# EAGLE design integratedBertha_no_weight (EAGLE 6.6.0)
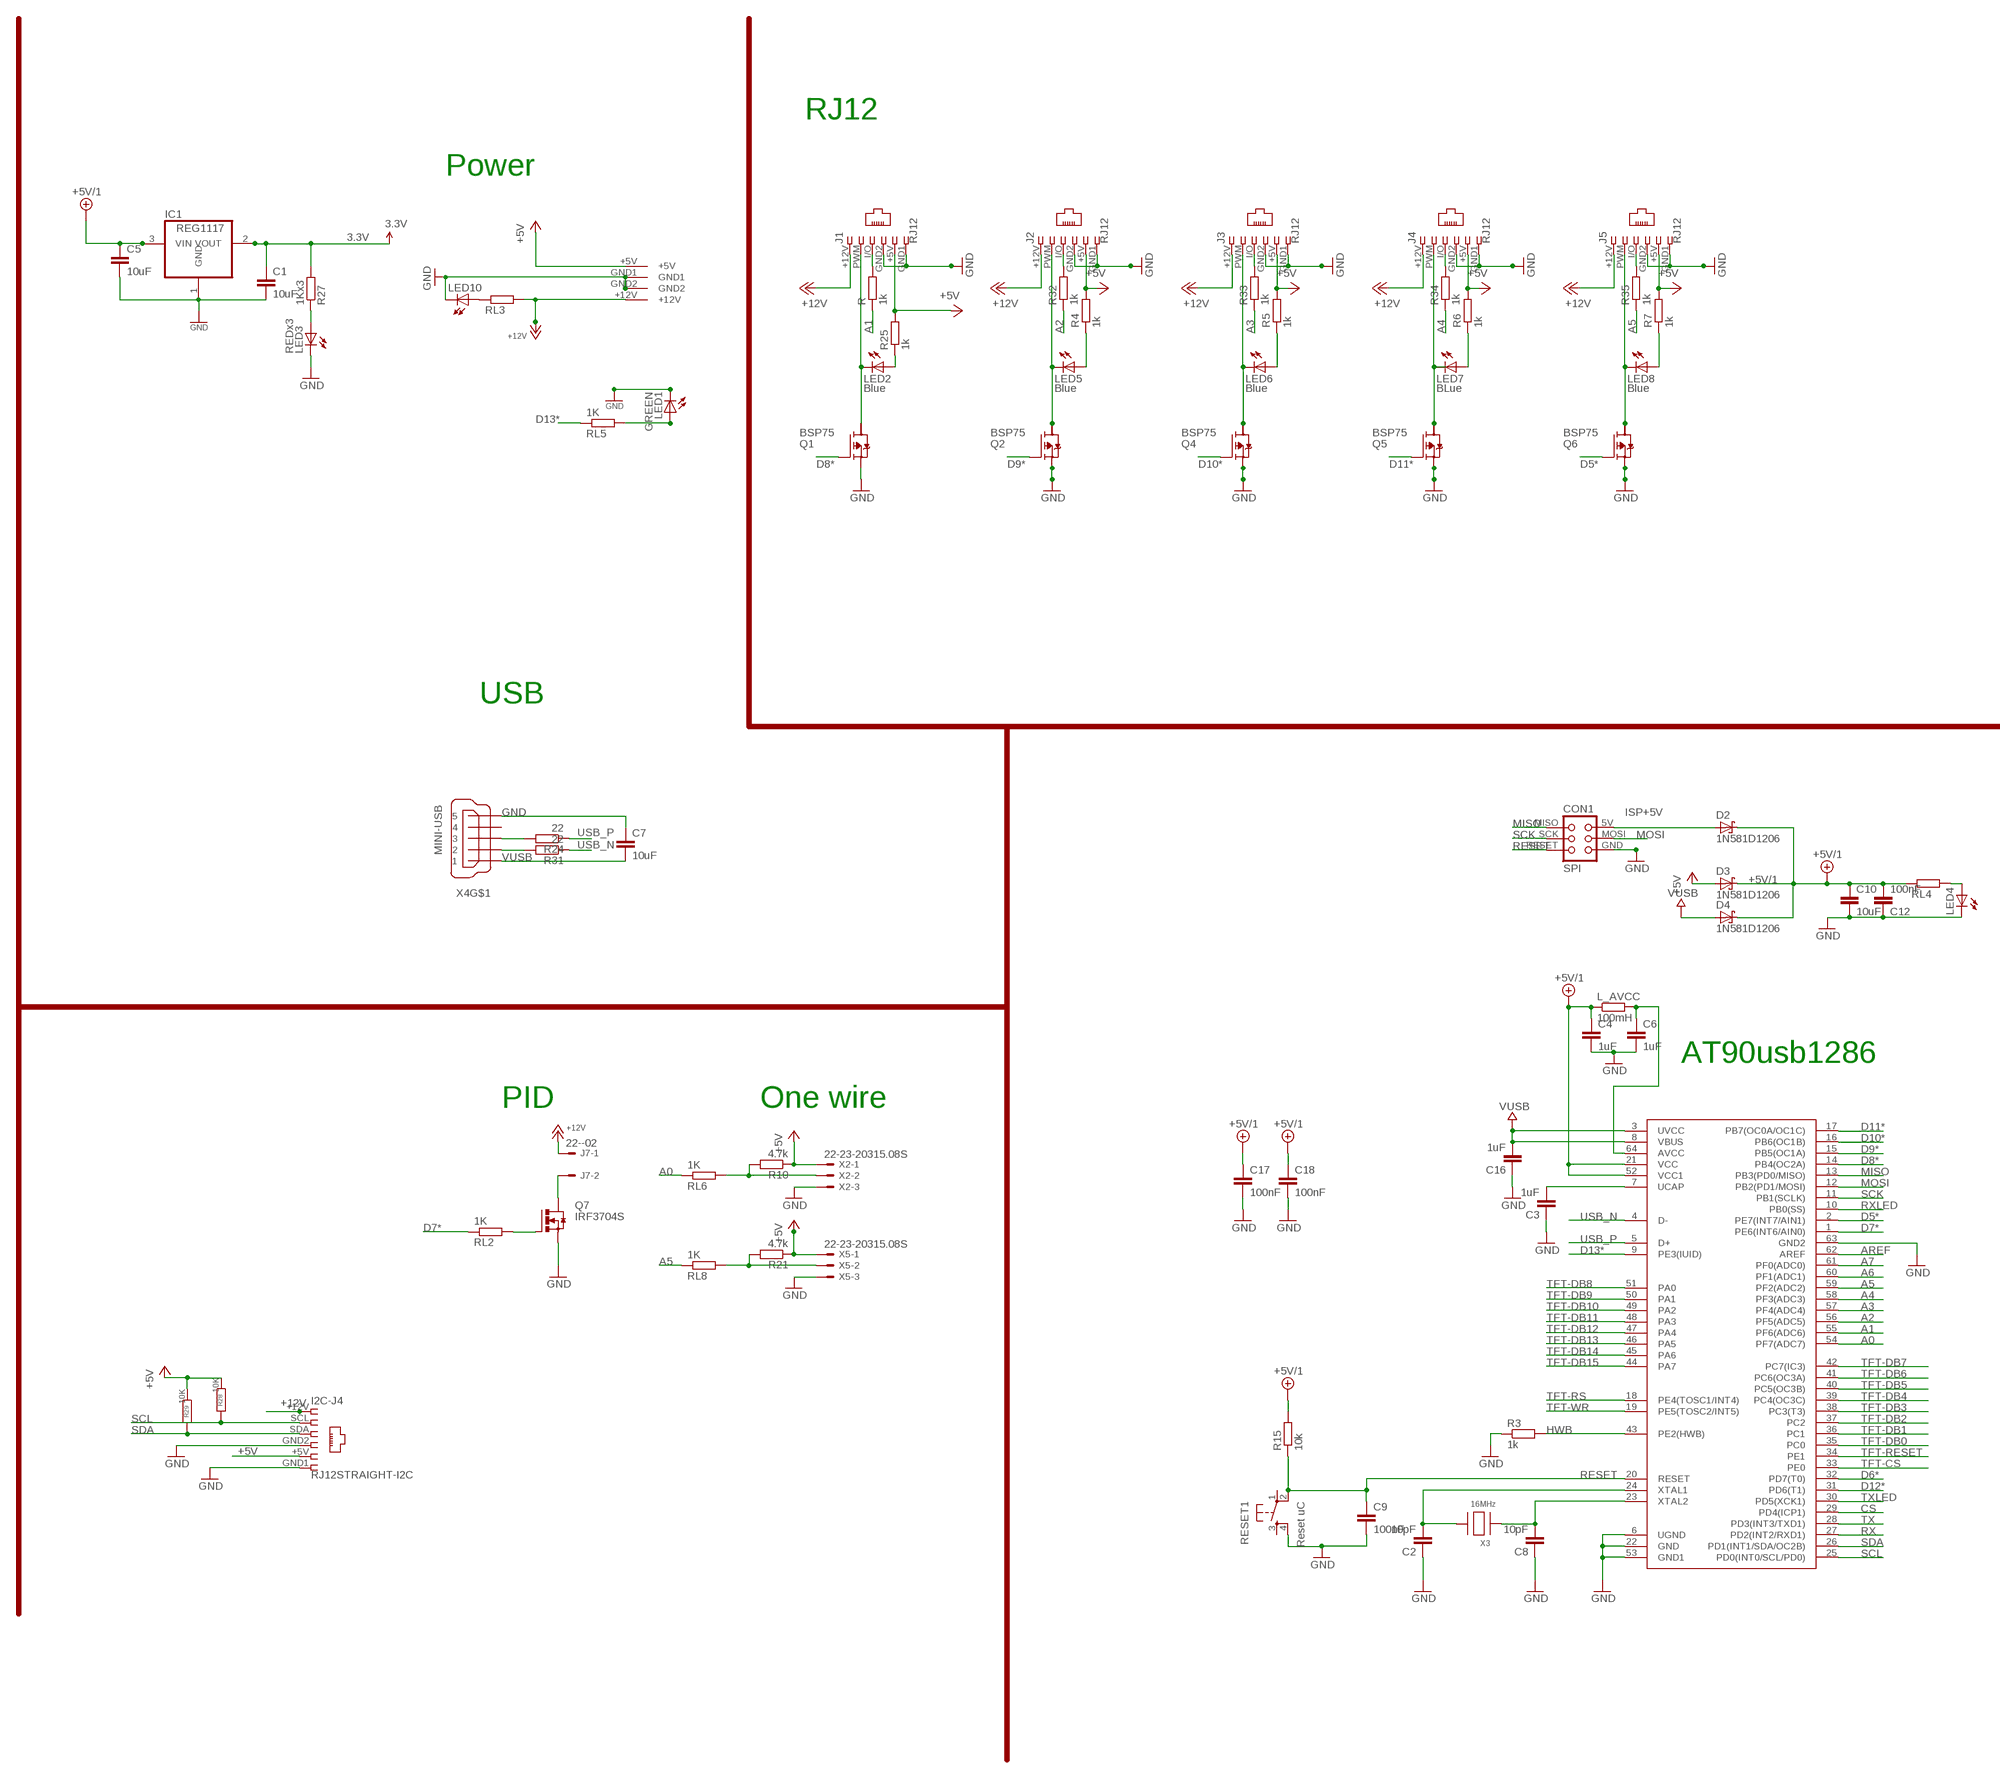
[diagram p0: schematic, sheet 1, part 1 of 2]
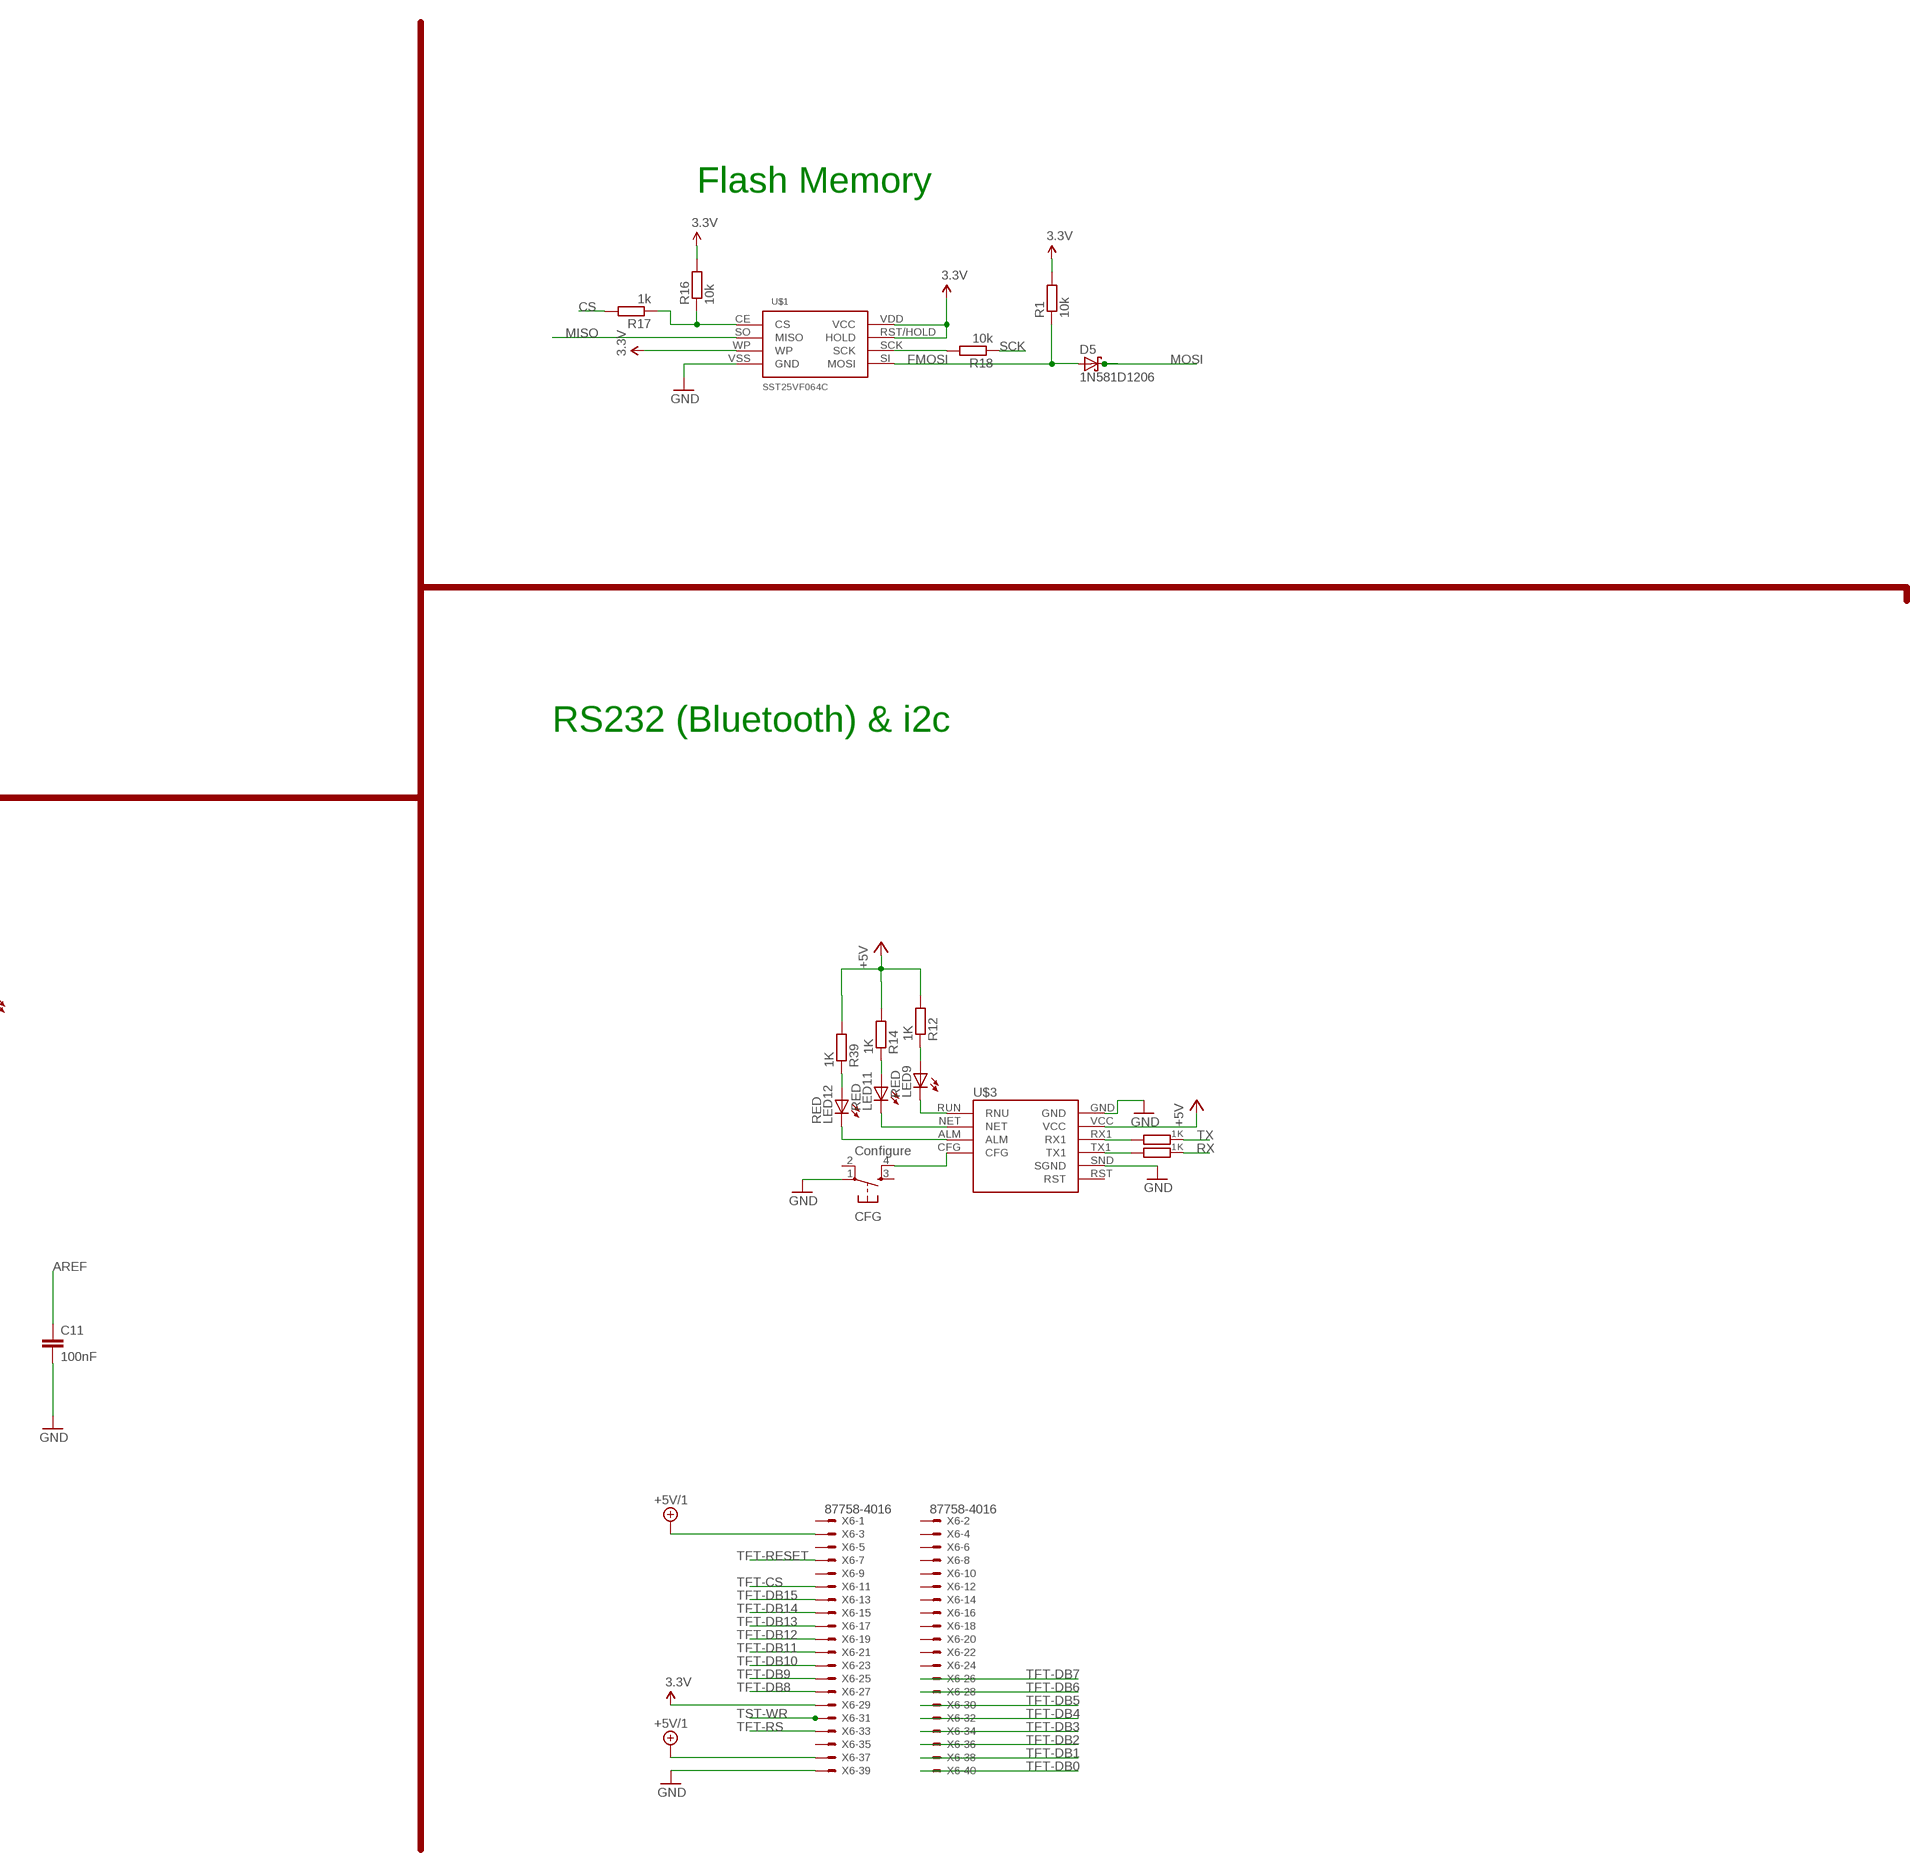
[diagram p1: schematic, sheet 1, part 2 of 2]

## Parts
C1  10uF  C-EUC1206  [C1206]
C2  10pF  C-EUC1206  [C1206]
C3  1uF  C-EUC1206  [C1206]
C4  1uF  C-EUC1206  [C1206]
C5  10uF  C-EUC1206  [C1206]
C6  1uF  C-EUC1206  [C1206]
C7  10uF  C-EUC1206  [C1206]
C8  10pF  C-EUC1206  [C1206]
C9  100nF  C-EUC1206  [C1206]
C10  10uF  C-EUC1206  [C1206]
C11  100nF  C-EUC1206  [C1206]
C12  100nF  C-EUC1206  [C1206]
C16  1uF  C-EUC1206  [C1206]
C17  100nF  C-EUC1206  [C1206]
C18  100nF  C-EUC1206  [C1206]
CFG  Configure  TAC_SWITCHSMD  [TACTILE_SWITCH_SMD]
CON1  SPI  TINYISPT  [TC2030-MCP-NL]
D2  1N581D1206  [LED-1206]
D3  1N581D1206  [LED-1206]
D4  1N581D1206  [LED-1206]
D5  1N581D1206  [LED-1206]
I2C-J4  RJ12STRAIGHT-I2C  [RJ12-STRAIGHT-I2C]
IC1  REG1117  [SOT223]
J1  RJ12  RJ12STRAIGHT  [RJ12-STRAIGHT]
J2  RJ12  RJ12STRAIGHT  [RJ12-STRAIGHT]
J3  RJ12  RJ12STRAIGHT  [RJ12-STRAIGHT]
J4  RJ12  RJ12STRAIGHT  [RJ12-STRAIGHT]
J5  RJ12  RJ12STRAIGHT  [RJ12-STRAIGHT]
J7  22--02  [2-PIN-5.08S]
L_AVCC  100mH  R-EU_R1206  [R1206]
LED1  GREEN  LEDCHIPLED_1206  [CHIPLED_1206]
LED2  Blue  LEDCHIPLED_1206  [CHIPLED_1206]
LED3  REDx3  LEDCHIPLED_1206  [CHIPLED_1206]
LED4  LEDCHIPLED_1206  [CHIPLED_1206]
LED5  Blue  LEDCHIPLED_1206  [CHIPLED_1206]
LED6  Blue  LEDCHIPLED_1206  [CHIPLED_1206]
LED7  BLue  LEDCHIPLED_1206  [CHIPLED_1206]
LED8  Blue  LEDCHIPLED_1206  [CHIPLED_1206]
LED9  RED  LEDCHIPLED_1206  [CHIPLED_1206]
LED10  LEDCHIPLED_1206  [CHIPLED_1206]
LED11  RED  LEDCHIPLED_1206  [CHIPLED_1206]
LED12  RED  LEDCHIPLED_1206  [CHIPLED_1206]
Q1  BSP75  BSP613P  [PG-SOT-223]
Q2  BSP75  BSP613P  [PG-SOT-223]
Q4  BSP75  BSP613P  [PG-SOT-223]
Q5  BSP75  BSP613P  [PG-SOT-223]
Q6  BSP75  BSP613P  [PG-SOT-223]
Q7  IRF3704S  [D2PACK]
R  1k  R-EU_R0805  [R0805]
R1  10k  R-EU_R0805  [R0805]
R3  1k  R-EU_M0805  [M0805]
R4  1k  R-EU_R0805  [R0805]
R5  1k  R-EU_R0805  [R0805]
R6  1k  R-EU_R0805  [R0805]
R7  1k  R-EU_R0805  [R0805]
R8  1K  R-EU_R0805  [R0805]
R10  4.7k  R-EU_R1206  [R1206]
R11  1K  R-EU_R0805  [R0805]
R12  1K  R-EU_R0805  [R0805]
R14  1K  R-EU_R0805  [R0805]
R15  10k  R-EU_M0805  [M0805]
R16  10k  R-EU_R0805  [R0805]
R17  1k  R-EU_R0805  [R0805]
R18  10k  R-EU_R0805  [R0805]
R21  4.7k  R-EU_R1206  [R1206]
R24  22  R-EU_M1206  [M1206]
R25  1k  R-EU_R0805  [R0805]
R27  1Kx3  R-EU_R0805  [R0805]
R28  10K  R-EU_M0805  [M0805]
R29  10K  R-EU_M0805  [M0805]
R31  22  R-EU_M1206  [M1206]
R32  1k  R-EU_R0805  [R0805]
R33  1k  R-EU_R0805  [R0805]
R34  1k  R-EU_R0805  [R0805]
R35  1k  R-EU_R0805  [R0805]
R39  1K  R-EU_R0805  [R0805]
RESET1  Reset uC  TAC_SWITCHSMD  [TACTILE_SWITCH_SMD]
RL2  1K  R-EU_R0805  [R0805]
RL3  R-EU_R0805  [R0805]
RL4  R-EU_R0805  [R0805]
RL5  1K  R-EU_R0805  [R0805]
RL6  1K  R-EU_R0805  [R0805]
RL8  1K  R-EU_R0805  [R0805]
U$1  SST25VF064C  [SOIC_8-LEAD]
U$2  AT90USB1286  AT90USB1286TQFP64  [TQFP64]
U$3  SZ05-ZIGBEETHROUGHHOLE  [SZ05-ZIGBEE4]
U$6  KPJX-4S-S  [KPJX-4S-S]
X2  22-23-20315.08S  [3-PIN-5.08S]
X3  16MHz  XTALNX6035  [NX6035]
X4  MINI-USB  MINI-USB-SCHIELD-32005-201  [32005-201]
X5  22-23-20315.08S  [3-PIN-5.08S]
X6  87758-4016  [87758-4016]

## Nets
3.3V [power]: C1.1 IC1.2(VOUT) R1.2 R16.2 R27.2 U$1.RST/HOLD(HOLD) U$1.VDD(VCC) U$1.WP X6.29
+5V [power]: D3.A I2C-J4.+5V J1.+5V J2.+5V J3.+5V J4.+5V J5.+5V R4.2 R5.2 R6.2 R7.2 R10.1 R12.2 R14.2 R21.1 R25.2 R28.1 R29.1 R39.2 U$3.VCC U$6.+5V X2.1 X5.1
+5V/1 [fine]: C4.1 C5.1 C10.1 C12.2 C17.1 C18.1 D2.C D3.C D4.C IC1.3(VIN) L_AVCC.1 R15.2 RL4.1 U$2.21(VCC) U$2.52(VCC1) X6.3 X6.37
+12V [power]: I2C-J4.+12V J1.+12V J2.+12V J3.+12V J4.+12V J5.+12V J7.1 RL3.2 U$6.+12V
A0: RL6.1 U$2.54(PF7(ADC7))
A1: R.1 U$2.55(PF6(ADC6))
A2: R32.1 U$2.56(PF5(ADC5))
A3: R33.1 U$2.57(PF4(ADC4))
A4: R34.1 U$2.58(PF3(ADC3))
A5: R35.1 RL8.1 U$2.59(PF2(ADC2))
A6: U$2.60(PF1(ADC1))
A7: U$2.61(PF0(ADC0))
AREF: C11.1 U$2.62(AREF)
CS: R17.2 U$2.29(PD4(ICP1))
D5*: Q6.1(G) U$2.2(PE7(INT7/AIN1))
D6*: U$2.32(PD7(T0))
D7*: RL2.1 U$2.1(PE6(INT6/AIN0))
D8*: Q1.1(G) U$2.14(PB4(OC2A))
D9*: Q2.1(G) U$2.15(PB5(OC1A))
D10*: Q4.1(G) U$2.16(PB6(OC1B))
D11*: Q5.1(G) U$2.17(PB7(OC0A/OC1C))
D12*: U$2.31(PD6(T1))
D13*: RL5.1 U$2.9(PE3(IUID))
FMOSI: D5.A R1.1 U$1.SI(MOSI)
GND [power]: C1.2 C2.1 C3.1 C4.2 C5.2 C6.2 C7.1 C8.1 C9.2 C10.2 C11.2 C12.1 C16.1 C17.2 C18.2 CFG.1 CON1.GND I2C-J4.GND1 I2C-J4.GND2 IC1.1(GND) J1.GND1 J1.GND2 J2.GND1 J2.GND2 J3.GND1 J3.GND2 J4.GND1 J4.GND2 J5.GND1 J5.GND2 LED1.C LED3.C LED4.C LED10.C Q1.3(S) Q2.3(S) Q4.3(S) Q5.3(S) Q6.3(S) Q7.3(S) R3.1 RESET1.4 U$1.VSS(GND) U$2.6(UGND) U$2.22(GND) U$2.53(GND1) U$2.63(GND2) U$3.GND U$3.SND(SGND) U$6.GND1 U$6.GND2 X2.3 X4.5 X5.3 X6.39
GND1 [VIN]: LED9.C U$3.RUN(RNU)
GND2 [VIN]: LED11.C U$3.NET
GND3 [VIN]: LED12.C U$3.ALM
HWB: R3.2 U$2.43(PE2(HWB))
ISP+5V: CON1.5V(VCC) D2.A
MISO: CON1.MISO U$1.SO(MISO) U$2.13(PB3(PD0/MISO))
MOSI: CON1.MOSI D5.C U$2.12(PB2(PD1/MOSI))
N$1: J3.PWM LED6.C Q4.2(D)
N$2: J2.I/O R32.2
N$3: LED1.A RL5.2
N$4: LED5.A R4.1
N$5: J4.PWM LED7.C Q5.2(D)
N$6: Q7.1(G) RL2.2
N$7: J3.I/O R33.2
N$8: C3.2 U$2.7(UCAP)
N$9 [power]: R21.2 RL8.2 X5.2
N$10: R16.1 R17.1 U$1.CE(CS)
N$11: R11.2 U$3.RX1
N$12: LED4.A RL4.2
N$13: C6.1 L_AVCC.2 U$2.64(AVCC)
N$14: C2.2 U$2.24(XTAL1) X3.P$2
N$17: LED2.A R25.1
N$18: J1.I/O R.2
N$19: J5.PWM LED8.C Q6.2(D)
N$20: LED3.A R27.1
N$21 [power]: R10.2 RL6.2 X2.2
N$22: LED6.A R5.1
N$23: R18.2 U$1.SCK
N$24: R8.2 U$3.TX1
N$25: LED9.A R12.1
N$26: LED11.A R14.1
N$27: LED12.A R39.1
N$28: J2.PWM LED5.C Q2.2(D)
N$29: J4.I/O R34.2
N$30: LED7.A R6.1
N$32: J5.I/O R35.2
N$33: LED8.A R7.1
N$34: J1.PWM LED2.C Q1.2(D)
N$35: CFG.4 U$3.CFG
N$36: J7.2 Q7.2(D)
N$39: C8.2 U$2.23(XTAL2) X3.P$1
N$75: LED10.A RL3.1
RESET: C9.1 CON1.RESET R15.1 RESET1.2 U$2.20(RESET)
RX: R8.1 U$2.27(PD2(INT2/RXD1))
RXLED: U$2.10(PB0(SS))
SCK: CON1.SCK R18.1 U$2.11(PB1(SCLK))
SCL: I2C-J4.SCL R28.2 U$2.25(PD0(INT0/SCL/PD0))
SDA: I2C-J4.SDA R29.2 U$2.26(PD1(INT1/SDA/OC2B))
TFT-CS: U$2.33(PE0) X6.11
TFT-DB0: U$2.35(PC0) X6.40
TFT-DB1: U$2.36(PC1) X6.38
TFT-DB2: U$2.37(PC2) X6.36
TFT-DB3: U$2.38(PC3(T3)) X6.34
TFT-DB4: U$2.39(PC4(OC3C)) X6.32
TFT-DB5: U$2.40(PC5(OC3B)) X6.30
TFT-DB6: U$2.41(PC6(OC3A)) X6.28
TFT-DB7: U$2.42(PC7(IC3)) X6.26
TFT-DB8: U$2.51(PA0) X6.27
TFT-DB9: U$2.50(PA1) X6.25
TFT-DB10: U$2.49(PA2) X6.23
TFT-DB11: U$2.48(PA3) X6.21
TFT-DB12: U$2.47(PA4) X6.19
TFT-DB13: U$2.46(PA5) X6.17
TFT-DB14: U$2.45(PA6) X6.15
TFT-DB15: U$2.44(PA7) X6.13
TFT-RESET: U$2.34(PE1) X6.7
TFT-RS: U$2.18(PE4(TOSC1/INT4)) X6.33
TFT-WR: U$2.19(PE5(TOSC2/INT5))
TST-WR: X6.31
TX: R11.1 U$2.28(PD3(INT3/TXD1))
TXLED: U$2.30(PD5(XCK1))
USB_N: R31.1 U$2.4(D-)
USB_P: R24.1 U$2.5(D+)
USBC_N: R31.2 X4.2
USBC_P: R24.2 X4.3
VUSB: C7.2 C16.2 D4.A U$2.3(UVCC) U$2.8(VBUS) X4.1
Unconnected: CFG.2 CFG.3 Q1.4(D) Q2.4(D) Q4.4(D) Q5.4(D) Q6.4(D) RESET1.1 RESET1.3 U$3.RST X4.4 X4.M1(S:S1) X4.M2(S:S2) X4.M3(S:S3) X4.M4(S:S4) X6.1 X6.2 X6.4 X6.5 X6.6 X6.8 X6.9 X6.10 X6.12 X6.14 X6.16 X6.18 X6.20 X6.22 X6.24 X6.35

## Notes on the sheet
- RJ12
- Power
- Flash Memory
- RS232 (Bluetooth) & i2c
- USB
- AT90usb1286
- PID | One wire

## Library data of the parts
C1-C12 C16-C18 = rcl:C-EU: CAPACITOR, European symbol
CFG RESET1 = lpatiny:TAC_SWITCH: Momentary Switch Button commonly used for reset or general input. Spark Fun Electronics SKU : COM-00097
CON1 = lpatiny:TINYISP: CONNECTOR
D2-D5 = lpatiny:1N581*: 1.0A SCHOTTKY BARRIER RECTIFIER Source: http://www.diodes.com/datasheets/ds23001.pdf
I2C-J4 J1-J5 = lpatiny:RJ12: CORCOM Modular RJ Jacks No Shield Source: www.tycoelectronics.com .. ENG_DS_1654001_1099_RJ_L_0507.pdf
IC1 = burr-brown:REG1117: 800mA and 1A Low Dropout (LDO) Positive Regulator 1.8V, 2.5V, 2.85V, 3.3V, 5V, and Adj; MPN: REG1117; OC_FARNELL: 1097566; OC_NEWARK: 14P6981
J7 = lpatiny:22-?-02: CONNECTOR wire to board 2.54 mm (.1 inch) pitch header
L_AVCC R3 R10 R15 R21 R24 R28 R29 R31 RL4 = resistor:R-EU_: RESISTOR, European symbol
LED1-LED12 = adafruit:LED: LED OSRAM: - CHIPLED LG R971, LG N971, LY N971, LG Q971, LY Q971, LO R971, LY R971 LH N974, LH R974 LS Q976, LO Q976, LY Q976 LO Q996 - Hyper CHIPLED LW Q18S LB Q993, LB Q99A, LB R99A - SideLED LS A670, LO A670, LY A670, LG A670, LP A670 LB A673, LV A673, LT A673, LW A673 LH A674 LY A675 LS A676, LA A676, LO A676, LY A676, LW A676 LS A679, LY A679, LG A679 - Hyper Micro SIDELED® LS Y876, LA Y876, LO Y876, LY Y876 LT Y87S - SmartLED LW L88C, LW L88S LB L89C, LB L89S, LG L890 LS L89K, LO L89K, LY L89K LS L896, LA L896, LO L896, LY L896 - TOPLED LS T670, LO T670, LY T670, LG T670, LP T670 LSG T670, LSP T670, LSY T670, LOP T670, LYG T670 LG T671, LOG T671, LSG T671 LB T673, LV T673, LT T673, LW T673 LH T674 LS T676, LA T676, LO T676, LY T676, LB T676, LH T676, LSB T676, LW T676 LB T67C, LV T67C, LT T67C, LS T67K, LO T67K, LY T67K, LW E67C LS E67B, LA E67B, LO E67B, LY E67B, LB E67C, LV E67C, LT E67C LW T67C LS T679, LY T679, LG T679 LS T770, LO T770, LY T770, LG T770, LP T770 LB T773, LV T773, LT T773, LW T773 LH T774 LS E675, LA E675, LY E675, LS T675 LS T776, LA T776, LO T776, LY T776, LB T776 LHGB T686 LT T68C, LB T68C - Hyper Mini TOPLED® LB M676 - Mini TOPLED Santana® LG M470 LS M47K, LO M47K, LY M47K Source: http://www.osram.convergy.de/
Q1 Q2 Q4-Q6 = infineon:BSP613P: SIPMOS (R) Small-Signal-Transistor P-Channel (2 Drain) Source: http://www.infineon.com/dgdl/BSP613P_Rev2.4.pdf; OC_FARNELL: unknown; OC_NEWARK: unknown
Q7 = transistor-power:IRF3704: SMPS MOSFET HEXFET® Power MOSFET Source: http://www.irf.com/product-info/datasheets/data/irf3704.pdf
R R1 R4-R8 R11 R12 R14 R16-R18 R25 R27 R32-R35 R39 RL2 RL3 RL5 RL6 RL8 = rcl:R-EU_: RESISTOR, European symbol
U$1 = BertaLib:SST25VF064C
U$2 = lpatiny:AT90USB1286
U$3 = lpatiny:SZ05-ZIGBEE
U$6 = lpatiny:KPJX-4S-S
X2 X5 = lpatiny:22-23-2031: .100" (2.54mm) Center Header - 3 Pin
X3 = lpatiny:XTAL: Low cost SMT crystals, no capacitors included http://www.ladyada.net/library/eagle
X4 = con-cypressindustries:MINI-USB-SCHIELD-: MINI USB-B Conector Source: www.cypressindustries.com; OC_FARNELL: unknown; OC_NEWARK: unknown
X6 = con-molex:87758-4016: 40 Pin - 2mm Dual Row Single Wafer, Vertical T/H HDR Source: http://www.molex.com/pdm_docs/sd/877580616_sd.pdf; MPN: 87758-4016; OC_FARNELL: unknown; OC_NEWARK: 25M5691

## Net classes
0 default: width 0.356 mm
1 power: width 0.457 mm
2 VIN: width 0.457 mm
3 fine: width 0.356 mm
4 aref: width 0.356 mm

## Board
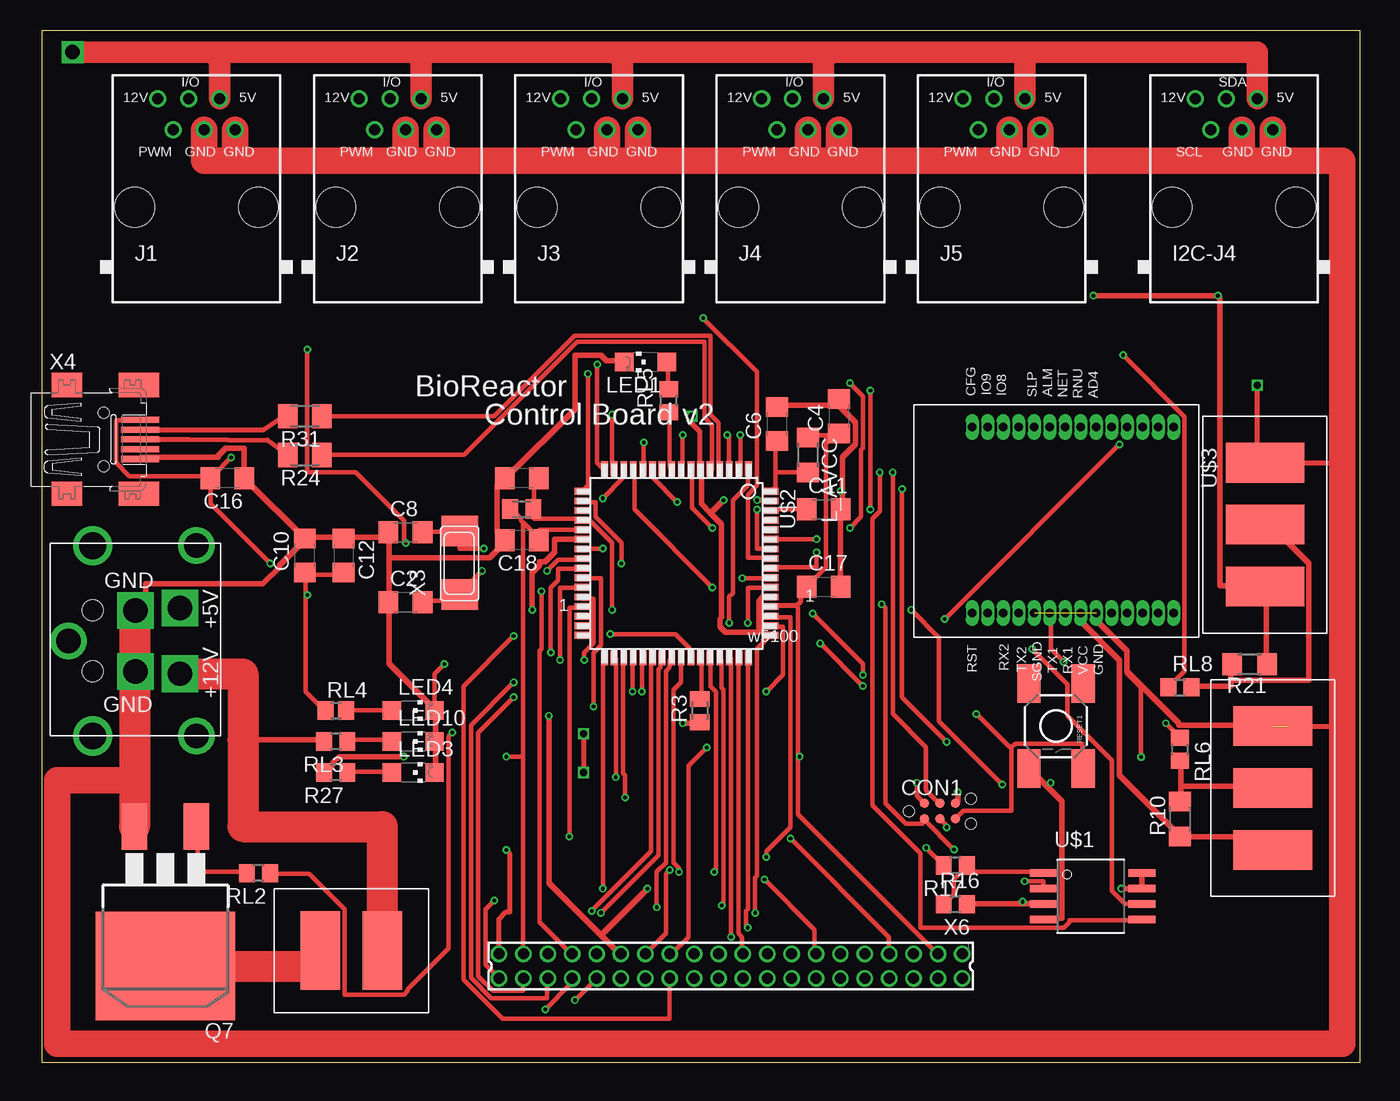
[diagram p2: board, top side]
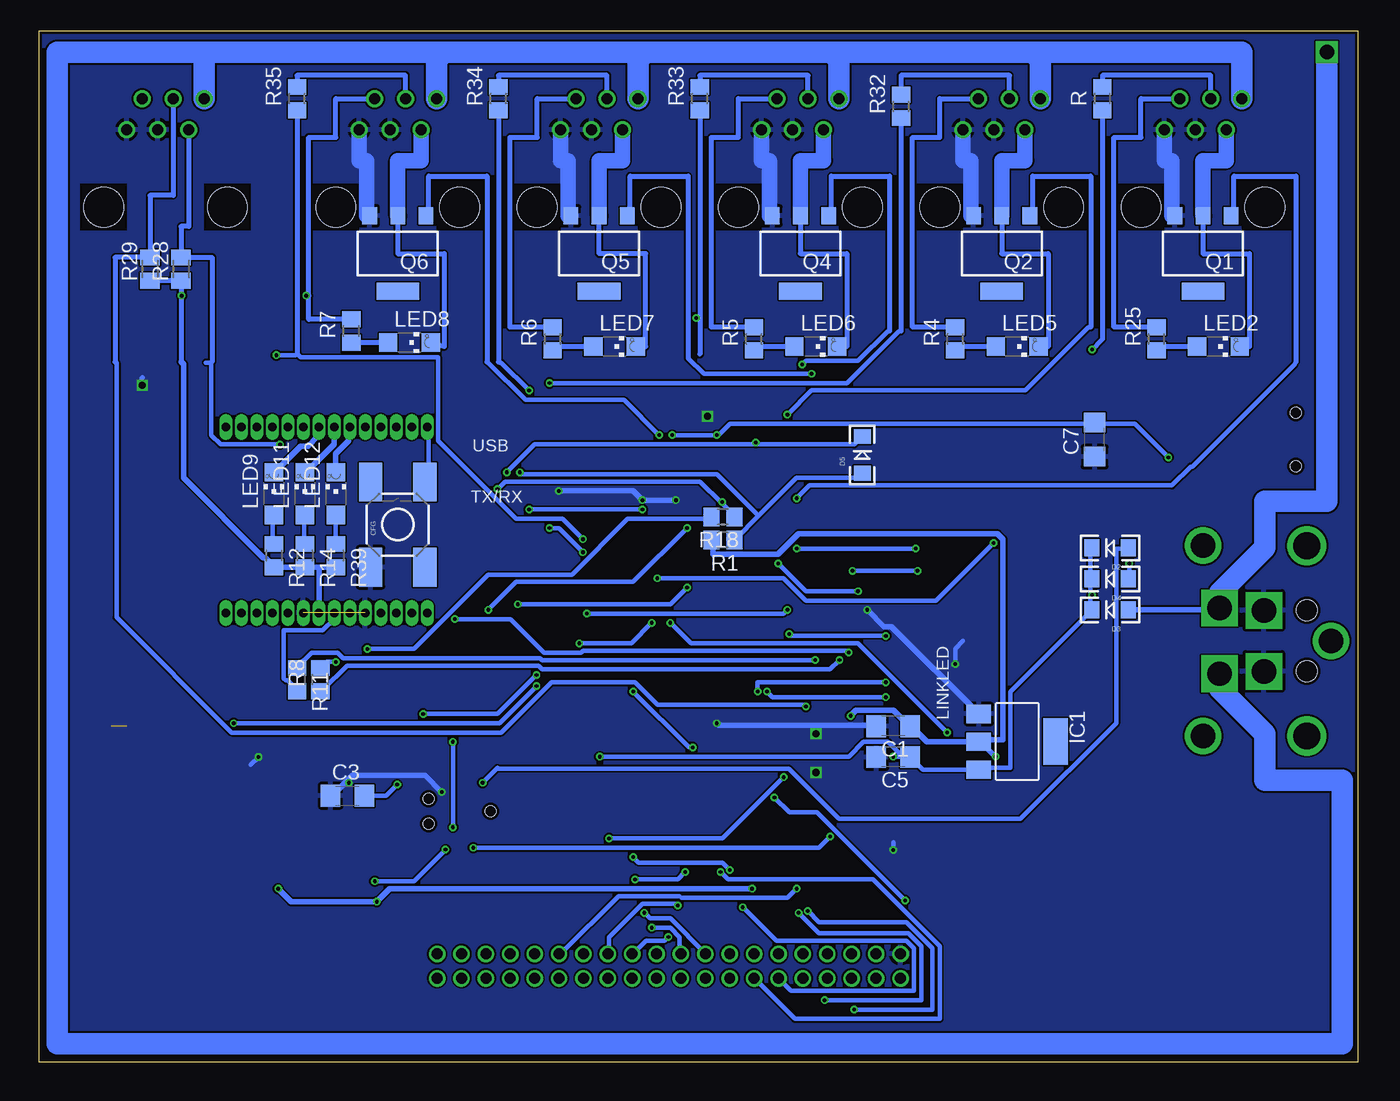
[diagram p3: board, bottom side, seen from below]

Size 108.13 x 84.57 mm. Coordinates in mm from the lower left corner, seen from the top.
Outline: 0,0 108.13,0 108.13,84.57 0,84.57 0,0
Copper layers (1*2*15*16): Top 0.035mm / dielectric 0.2mm / layer 2 0.0175mm / dielectric 1.1mm / layer 15 0.0175mm / dielectric 0.2mm / Bottom 0.035mm
Design rules "SeeedStudio_DRU_no_angle_20130527": minimum track width 6mil, minimum drill 12mil, track to track 6mil, track to pad 6mil, pad to pad 6mil, via to via 6mil, smd to smd 0mil, copper to edge 10mil, drill to drill 10mil, minimum pad ring 6mil, minimum via ring 6mil, stop-mask expansion 2mil, vias tented up to drill 25mil, thermal gap 10mil
tKeepout: area 65.4,36.4 to 72.4,49.1
vRestrict: area 45.1,30.7 to 60.3,34.5; area 41.9,33.9 to 45.7,47.9; area 59.1,34.5 to 62.9,47.2; area 45.1,46.6 to 60.3,50.4; area 94.6,12.3 to 107.3,54.2; area 0,0.3 to 35.6,22.5

### Footprints (pad centres in the part's own frame; a part is rotated, then mirrored left to right if it is on the bottom)
C1206 = smd 1.6 x 1.8: 1 -1.4,0; 2 1.4,0
TACTILE_SWITCH_SMD = smd 3.175 x 1.905: 1 -3.493,2.223; 2 3.493,2.223; 3 -3.493,-2.223; 4 3.493,-2.223
TC2030-MCP-NL = smd 0.787 x 0.787: 5V 1.27,0.635; GND 3.81,0.635; MISO 1.27,-0.635; MOSI 2.54,0.635; RESET 3.81,-0.635; SCK 2.54,-0.635 | hole 0.889: 0,0; 5.08,-1.016; 5.08,1.016
LED-1206 = smd 1.2 x 1.4: A -1.5,0; C 1.5,0
RJ12-STRAIGHT-I2C = drill 0.9 pad 1.4: +5V 1.905,8.89; +12V -3.175,8.89; GND1 3.175,6.35; GND2 0.635,6.35; SCL -1.905,6.35; SDA -0.635,8.89 | hole 3.251: -5.08,0; 5.08,0
SOT223 = smd 1.499 x 2.007: 1 -2.261,-3.15; 2 0.025,-3.15; 3 2.311,-3.15 | smd 3.81 x 2.007: 4 0,3.15
RJ12-STRAIGHT = drill 0.9 pad 1.4: +5V 1.905,8.89; +12V -3.175,8.89; GND1 3.175,6.35; GND2 0.635,6.35; I/O -0.635,8.89; PWM -1.905,6.35 | hole 3.251: -5.08,0; 5.08,0
2-PIN-5.08S = smd 3.251 x 6.452: 1 -2.54,0; 2 2.54,0
R1206 = smd 1.6 x 1.803: 1 -1.422,0; 2 1.422,0
CHIPLED_1206 = smd 1.5 x 1.5: A 0,-1.75; C 0,1.75
PG-SOT-223 = smd 1.2 x 1.4: 1 -2.311,-3.099; 2 0,-3.099; 3 2.311,-3.099 | smd 3.5 x 1.4: 4 0,3.099
D2PACK = smd 2.083 x 3.81: 1 -2.54,-8.89; 3 2.54,-8.89 | smd 11.43 x 8.89: 2 0,2.54
R0805 = smd 1.3 x 1.5: 1 -0.95,0; 2 0.95,0
M0805 = smd 1.3 x 1.6: 1 -0.95,0; 2 0.95,0
M1206 = smd 1.6 x 2: 1 -1.4,0; 2 1.4,0
R0805' = smd 1.3 x 1.5: 1 -0.85,0; 2 0.85,0
SOIC_8-LEAD = smd 0.61 x 2.21: CE -1.905,-2.934; RST/HOLD -0.635,5.156; SCK 0.635,5.156; SI 1.905,5.156; SO -0.635,-2.934; VDD -1.905,5.156; VSS 1.905,-2.934; WP 0.635,-2.934
TQFP64 = smd 1.194 x 0.559: 1 -7.76,5.905; 2 -7.76,5.118; 3 -7.76,4.331; 4 -7.76,3.543; 5 -7.76,2.756; 6 -7.76,1.968; 7 -7.76,1.181; 8 -7.76,0.394; 9 -7.76,-0.394; 10 -7.76,-1.181; 11 -7.76,-1.968; 12 -7.76,-2.756; 13 -7.76,-3.543; 14 -7.76,-4.331; 15 -7.76,-5.118; 16 -7.76,-5.905; 33 7.76,-5.905; 34 7.76,-5.118; 35 7.76,-4.331; 36 7.76,-3.543; 37 7.76,-2.756; 38 7.76,-1.968; 39 7.76,-1.181; 40 7.76,-0.394; 41 7.76,0.394; 42 7.76,1.181; 43 7.76,1.968; 44 7.76,2.756; 45 7.76,3.543; 46 7.76,4.331; 47 7.76,5.118; 48 7.76,5.905 | smd 0.559 x 1.194: 17 -5.905,-7.76; 18 -5.118,-7.76; 19 -4.331,-7.76; 20 -3.543,-7.76; 21 -2.756,-7.76; 22 -1.968,-7.76; 23 -1.181,-7.76; 24 -0.394,-7.76; 25 0.394,-7.76; 26 1.181,-7.76; 27 1.968,-7.76; 28 2.756,-7.76; 29 3.543,-7.76; 30 4.331,-7.76; 31 5.118,-7.76; 32 5.905,-7.76; 49 5.905,7.76; 50 5.118,7.76; 51 4.331,7.76; 52 3.543,7.76; 53 2.756,7.76; 54 1.968,7.76; 55 1.181,7.76; 56 0.394,7.76; 57 -0.394,7.76; 58 -1.181,7.76; 59 -1.968,7.76; 60 -2.756,7.76; 61 -3.543,7.76; 62 -4.331,7.76; 63 -5.118,7.76; 64 -5.905,7.76
SZ05-ZIGBEE4 = drill 0.7 pad 1.016 long: AD1 -6.985,6.35; AD2 -6.985,5.08; AD3 -6.985,3.81; AD4 -6.985,2.54; ALM -6.985,-1.27; C485 -6.985,-3.81; CFG -6.985,-7.62; GND 8.255,2.54; IO1 -6.985,8.89; IO2 -6.985,7.62; IO3 8.255,8.89; IO4 8.255,7.62; IO5 8.255,6.35; IO6 8.255,5.08; IO7 8.255,3.81; IO8 -6.985,-5.08; IO9 -6.985,-6.35; MS 8.255,-6.35; NET -6.985,0; RST 8.255,-7.62; RUN -6.985,1.27; RX1 8.255,0; RX2 8.255,-5.08; SLD -6.985,-2.54; SND 8.255,-2.54; TX1 8.255,-1.27; TX2 8.255,-3.81; VCC 8.255,1.27
KPJX-4S-S = drill 2 square: +5V 2.7,1.35; +12V -2.7,1.35; GND1 -2.5,5; GND2 2.5,5 | drill 2: P$1 -7.8,0; P$2 7.8,0; P$11 0,10.5 | drill 2.2: P$3 -7.8,8.5; P$4 7.8,8.5 | hole 1.7: -2.5,8.5; 2.5,8.5
3-PIN-5.08S = smd 3.251 x 6.452: 1 -5.08,0; 2 0,0; 3 5.08,0
NX6035 = smd 2.5 x 3: P$1 2.665,0; P$2 -2.565,0
32005-201 = smd 3.1 x 0.5: 1 3,1.6; 2 3,0.8; 3 3,0; 4 3,-0.8; 5 3,-1.6 | smd 2.5 x 2: M1 -3,-4.45; M2 -3,4.45 | smd 3.3 x 2: M3 2.9,4.45; M4 2.9,-4.45 | hole 0.9: 0,2.2; 0,-2.2
87758-4016 = drill 0.9 pad 1.27: 1 -19,-1; 2 -19,1; 3 -17,-1; 4 -17,1; 5 -15,-1; 6 -15,1; 7 -13,-1; 8 -13,1; 9 -11,-1; 10 -11,1; 11 -9,-1; 12 -9,1; 13 -7,-1; 14 -7,1; 15 -5,-1; 16 -5,1; 17 -3,-1; 18 -3,1; 19 -1,-1; 20 -1,1; 21 1,-1; 22 1,1; 23 3,-1; 24 3,1; 25 5,-1; 26 5,1; 27 7,-1; 28 7,1; 29 9,-1; 30 9,1; 31 11,-1; 32 11,1; 33 13,-1; 34 13,1; 35 15,-1; 36 15,1; 37 17,-1; 38 17,1; 39 19,-1; 40 19,1

### Placement (x,y rotation side)
C1  38.1,27.56 180 bottom
C2  29.84,37.72 0 top
C3  82.87,21.84 0 bottom
C4  65.41,52.96 90 top
C5  38.1,25.02 180 bottom
C6  60.33,52.32 90 top
C7  21.59,51.05 90 bottom
C8  29.84,43.43 0 top
C9  39.37,47.88 180 top
C10  21.59,41.53 90 top
C11  64.14,45.34 0 top
C12  24.77,41.53 270 top
C16  15.24,47.88 180 top
C17  64.14,38.99 0 top
C18  39.37,42.8 180 top
CFG  78.74,44.07 90 bottom
CON1  71.12,20.57 0 top
D2  20.32,42.16 180 bottom
D3  20.32,37.08 180 bottom
D4  20.32,39.62 180 bottom
D5  40.64,49.78 90 bottom
I2C-J4  97.79,70.1 0 top
IC1  27.94,26.29 270 bottom
J1  12.7,70.1 0 top
J2  29.21,70.1 0 top
J3  45.72,70.1 0 top
J4  62.23,70.1 0 top
J5  78.74,70.1 0 top
J7  25.4,9.14 180 top
L_AVCC  62.87,49.78 270 top
LED1  49.53,57.4 90 top
LED2  11.43,58.67 270 bottom
LED3  30.48,23.75 270 top
LED4  30.48,28.83 270 top
LED5  27.94,58.67 270 bottom
LED6  44.45,58.67 270 bottom
LED7  60.96,58.67 270 bottom
LED8  77.79,58.99 270 bottom
LED9  88.9,46.61 0 bottom
LED10  30.48,26.29 270 top
LED11  86.36,46.61 0 bottom
LED12  83.82,46.61 0 bottom
Q1  12.7,66.29 180 bottom
Q2  29.21,66.29 180 bottom
Q4  45.72,66.29 180 bottom
Q5  62.23,66.29 180 bottom
Q6  78.74,66.29 180 bottom
Q7  10.16,10.41 180 top
R  20.95,78.99 90 bottom
R1  52.07,42.8 180 bottom
R3  53.98,28.83 90 top
R4  33.02,59.31 90 bottom
R5  49.53,59.31 90 bottom
R6  66.04,59.31 90 bottom
R7  82.55,59.94 90 bottom
R8  85.09,31.37 90 bottom
R10  93.34,19.94 90 top
R11  87,31.37 270 bottom
R12  88.9,41.53 270 bottom
R14  86.36,41.53 270 bottom
R15  39.37,45.34 180 top
R16  74.93,12.95 0 top
R17  74.93,16.13 180 top
R18  52.07,44.7 180 bottom
R21  99.06,32.64 180 top
R24  21.59,49.78 180 top
R25  16.51,59.31 90 bottom
R27  24.13,23.75 180 top
R28  96.52,65.02 90 bottom
R29  99.06,65.02 90 bottom
R31  21.59,52.96 180 top
R32  37.47,78.36 90 bottom
R33  53.98,78.99 90 bottom
R34  70.48,78.99 90 bottom
R35  87,78.99 90 bottom
R39  83.82,41.53 270 bottom
RESET1  83.19,27.56 270 top
RL2  17.78,15.49 180 top
RL3  24.13,26.29 180 top
RL4  [R0805']  24.13,28.83 0 top
RL5  51.44,54.23 90 top
RL6  93.34,25.65 270 top
RL8  93.34,30.73 0 top
U$1  85.09,13.59 270 top
U$2  52.07,40.89 270 top
U$3  83.95,45.08 270 top
U$6  12.7,34.54 90 top
X2  100.97,22.48 90 top
X3  34.29,40.89 90 top
X4  5.08,51.05 0 top
X5  100.33,44.07 90 top
X6  56.52,7.87 180 top

### Tracks (layer width: path | path; a pad name or v marks a point on that pad's centre or on a via)
3.3V  (via drill 0.3)
  Top 0.457: U$1.VDD 90.22,15.44 90.22,14.22 U$1.RST/HOLD v88.54,14.22 | 80.47,13.01 82.14,13.01 U$1.WP | 80.47,13.01 75.89,13.01 R16.2 | v80.47,13.16 80.47,13.01 | v29.72,25.04 24.38,25.04 23.93,24.59 23.93,24.43 23.32,23.82 R27.2 | 45.87,10.41 41.6,14.68 v41.6,28.4 | 45.87,10.41 47.4,8.89 X6.29 | 45.87,10.41 v49.68,14.22
  Bottom 0.457: v88.54,14.22 87.48,13.16 v80.47,13.16 79.4,14.22 v49.68,14.22 | v29.72,25.04 30.94,26.26 IC1.2 | R1.2 52.88,42.72 52.88,41.66 47.55,41.66 45.87,43.33 29.57,43.33 29.11,42.88 29.11,26.42 30.79,26.42 IC1.2 | IC1.2 35.36,26.26 36.58,27.48 C1.1 36.88,27.64 38.1,28.85 41.15,28.85 v41.6,28.4
+5V  (via drill 0.3, 1.2)
  Top 0.457: X2.1 100.89,17.42 100.89,18.49 93.42,18.49 R10.1 93.27,18.64 88.39,23.52 88.39,32.97 85.34,36.02 85.34,36.78 U$3.VCC | R21.1 100.43,32.66 100.43,38.91 X5.1 100.13,39.06 96.62,39.06 96.62,62.69 v96.47,62.84 v86.26,62.84
  Top 1.778: v2.54,82.8 13.97,82.8 | 13.97,82.8 30.48,82.8 | 30.48,82.8 46.99,82.8 | 46.99,82.8 64.77,82.8 | 64.77,82.8 81.28,82.8 | 81.28,82.8 99.69,82.8 I2C-J4.+5V | J1.+5V 14.61,82.17 13.97,82.8 | J2.+5V 31.11,82.17 30.48,82.8 | J3.+5V 47.62,82.17 46.99,82.8 | J4.+5V 64.14,82.17 64.77,82.8 | J5.+5V 80.64,82.17 81.28,82.8
  Bottom 0.406: R25.2 20,60.26 20,75.82 17.78,75.82 17.78,78.99 J1.+5V | R4.2 36.51,60.26 36.51,75.82 34.29,75.82 34.29,78.99 J2.+5V | R5.2 53.02,60.26 53.02,75.82 50.8,75.82 50.8,78.99 J3.+5V | R6.2 69.53,60.26 69.53,75.82 67.31,75.82 67.31,78.99 J4.+5V | R7.2 86.04,60.89 86.04,62.84 86.04,75.82 83.82,75.82 83.82,78.99 J5.+5V | R29.1 R28.1 96.52,62.84 96.52,57.4
  Bottom 0.457: 12.19,37.08 U$6.+5V 12.34,37.08 D3.A | 85.19,40.59 86.26,40.59 R14.2 86.56,40.59 88.85,40.59 R12.2 89,40.74 89.61,41.35 89.76,41.35 96.32,47.9 96.32,57.2 96.52,57.4 | 85.19,40.59 83.82,40.59 R39.2 | 85.19,40.59 85.19,36.93 U$3.VCC | v86.26,62.84 86.04,62.84 | v96.47,62.84 96.52,62.84
  Bottom 1.778: U$6.+5V 11.35,38.43 7.62,42.16 7.62,45.97 2.54,45.97 v2.54,82.8
+5V/1  (via drill 0.3)
  Top 0.356: 64.31,51.41 62.94,51.41 62.94,51.26 L_AVCC.1 | 64.31,51.41 65.38,51.41 C4.1 | 62.03,25.04 62.03,37.24 61.91,37.4 | 62.03,25.04 62.03,20.32 73.46,8.89 X6.3 | 64.31,51.41 64.31,40.59 62.79,39.06 C17.1 | 21.64,38.3 21.64,39.98 C10.1 21.79,39.98 24.69,39.98 C12.2 | 21.64,38.3 21.64,30.38 23.16,28.85 RL4.1 | v21.79,38.3 21.64,38.3 | U$2.21 44.2,43.64 40.84,43.64 40.84,42.88 C18.1 40.69,43.03 39.55,44.17 | 39.55,44.17 39.32,44.4 39.32,44.55 38.56,45.31 R15.2 | 39.47,25.04 39.47,44.09 39.55,44.17 | 39.47,25.04 39.47,8.89 X6.37 | 39.47,25.04 v38.1,25.04 | v62.18,25.04 62.03,25.04
  Top 0.406: C17.1 62.23,38.99 62.23,37.72 61.91,37.4 59.88,37.4 U$2.52
  Bottom 0.356: 21.95,38.3 21.95,39.52 D4.C 21.95,39.67 21.95,42.11 D2.C | 21.95,38.3 21.95,37.08 D3.C 21.95,36.93 28.5,30.38 28.5,24.13 31.09,24.13 IC1.3 35.66,23.98 36.58,24.89 C5.1 | v21.79,38.3 21.95,38.3 | v38.1,25.04 36.73,25.04 C5.1 | v62.18,25.04 41.76,25.04 40.54,26.26 38.56,26.26 37.49,25.2 C5.1
+12V
  Top 0.457: 16.51,26.42 23.16,26.42 RL3.2
  Top 2.54: U$6.+12V 16.51,31.84 16.51,26.42 16.51,19.3 27.94,19.3 J7.1
  Bottom 1.778: 94.61,82.8 106.68,82.8 106.68,1.52 1.27,1.52 1.27,23.11 7.62,23.11 7.62,26.92 11.35,30.65 U$6.+12V | 94.61,82.8 74.93,82.8 | 74.93,82.8 58.42,82.8 | 58.42,82.8 43.18,82.8 | 43.18,82.8 26.67,82.8 | 26.67,82.8 9.53,82.8 J1.+12V | J3.+12V 42.55,82.17 43.18,82.8 | J4.+12V 59.05,82.17 58.42,82.8 | J5.+12V 75.56,82.17 74.93,82.8 | J2.+12V 26.04,82.17 26.67,82.8 | I2C-J4.+12V 94.61,82.8
A0  (via drill 0.3)
  Top 0.356: v57.91,36.02 57.91,38.91 59.74,38.91 U$2.54 | v67.36,30.84 v63.86,34.34 | v92.2,27.79 93.27,26.72 RL6.1
  Bottom 0.356: v57.91,36.02 59.59,34.34 v63.86,34.34 | v67.36,30.84 70.41,27.79 v92.2,27.79
A1  (via drill 0.3)
  Top 0.356: v57.45,39.67 59.74,39.67 U$2.55 | v29.87,42.57 29.72,42.72 29.72,44.4 25.76,48.36 21.79,48.36 v21.79,58.42
  Bottom 0.356: v57.45,39.67 47.09,39.67 45.26,37.85 34.59,37.85 v29.87,42.57 | v21.79,58.42 21.03,59.18 20.95,59.31
  Bottom 0.406: R.1 20.95,59.31
A2  (via drill 0.3)
  Top 0.356: v63.55,41.81 63.55,40.59 59.89,40.59 U$2.56 | v66.29,43.79 67.21,44.7 67.21,50.19 67.36,50.34 67.36,54.61 v66.29,55.68
  Bottom 0.356: v63.55,41.81 65.53,43.79 v66.29,43.79 | v66.29,55.68 41.91,55.68 37.64,59.94 37.47,59.94
  Bottom 0.406: R32.1 37.47,59.94
A3  (via drill 0.3)
  Top 0.356: v54.25,61.01 58.67,56.59 58.67,47.29 57.91,46.53 57.91,41.35 59.74,41.35 U$2.57
  Bottom 0.356: 53.98,61.01 v54.25,61.01
  Bottom 0.406: R33.1 53.98,61.01 53.98,58.04
A4  (via drill 0.3)
  Top 0.356: v58.67,45.31 58.67,42.11 59.74,42.11 U$2.58 | v67.97,55.07 v67.97,45.31
  Bottom 0.356: v67.97,45.31 v58.67,45.31 | v67.97,55.07 70.26,57.35 70.41,57.35 70.48,57.4
  Bottom 0.406: R34.1 70.48,57.4
A5  (via drill 0.3)
  Top 0.356: v63.55,42.88 59.89,42.88 U$2.59 | v88.7,57.96 93.73,52.93 93.73,32.05 92.51,30.84 RL8.1
  Bottom 0.356: v63.55,42.88 65.23,44.55 69.04,44.55 75.44,50.95 75.44,57.81 86.72,57.81 86.87,57.96 87,58.04 87.17,57.96 v88.7,57.96
  Bottom 0.406: R35.1 87,58.04
AREF
  Top 0.356: U$2.62 59.89,45.31 62.64,45.31 C11.1
CS  (via drill 0.3)
  Top 0.356: v43.28,18.49 43.28,37.24 44.2,37.24 U$2.29 | v72.54,17.58 73.91,16.2 R17.2
  Bottom 0.356: v43.28,18.49 44.2,17.58 v72.54,17.58
D5*  (via drill 0.3)
  Top 0.356: v57.3,51.41 57.3,48.67 U$2.2
  Bottom 0.356: v57.3,51.41 60.2,54.3 68.28,54.3 71.32,57.35 71.44,57.4
  Bottom 0.406: Q6.1 76.2,69.39 76.2,72.64 71.44,72.64 71.44,57.4
D7*  (via drill 0.3)
  Top 0.356: RL2.1 18.75,15.44 21.95,15.44 24.84,12.55 24.84,5.54 29.72,5.54 30.02,5.84 30.02,5.99 33.38,9.35 33.38,26.72 v33.68,27.03 | v56.39,36.02 56.39,38.15 56.69,38.46 56.69,46.08 57.91,47.29 57.91,48.51 U$2.1
  Bottom 0.356: v56.39,36.02 54.71,34.34 41,34.34 v33.68,27.03
D8*  (via drill 0.3)
  Top 0.356: v46.02,46.23 47.7,47.9 47.7,48.51 U$2.14
  Bottom 0.305: 5.18,57.25 5.08,57.4
  Bottom 0.356: 5.18,57.25 5.18,57.2 13.56,48.82 13.72,48.82 15.24,47.29 44.96,47.29 v46.02,46.23
  Bottom 0.406: Q1.1 10.16,69.39 10.16,72.64 5.08,72.64 5.08,57.4
D9*  (via drill 0.3)
  Top 0.356: U$2.15 46.79,48.82 v46.79,53.09
  Bottom 0.356: v46.79,53.09 44.81,55.07 27.28,55.07 22.1,60.25 21.91,60.26
  Bottom 0.406: Q2.1 26.67,69.39 26.67,72.64 21.91,72.64 21.91,60.26
D10*  (via drill 0.3)
  Top 0.356: v45.57,57.2 45.57,49.12 46.02,48.67 U$2.16
  Bottom 0.356: v45.57,57.2 45.26,57.51 41,57.51 38.56,59.94 38.42,59.94
  Bottom 0.406: Q4.1 43.18,69.39 43.18,72.64 38.42,72.64 38.42,59.94
D11*  (via drill 0.3)
  Top 0.356: U$2.17 44.81,47.29 v44.81,56.44
  Bottom 0.356: v44.81,56.44 53.65,56.44 54.93,57.72
  Bottom 0.406: Q5.1 59.69,69.39 59.69,72.64 54.93,72.64 54.93,57.72
D13*
  Top 0.356: U$2.9 51.51,48.82 51.51,53.24 RL5.1
FMOSI  (via drill 0.3)
  Top 0.356: v68.73,48.36 68.73,45.16 68.12,44.55 68.12,21.08 72.08,17.12 72.08,11.02 83.82,11.02 84.28,11.48 84.28,11.63 90.22,11.63 U$1.SI
  Bottom 0.356: 49.15,44.78 51.05,42.88 R1.1 | 49.15,44.78 46.02,47.9 41,47.9 40.69,48.21 D5.A | v68.73,48.36 68.58,48.21 52.58,48.21 49.15,44.78
GND  (via drill 0.3, 0.6)  (2 unrouted)
  Top 0.356: v90.17,25.02 90.17,30.73 89,31.9 89,32.05 | LED4.C 32.23,31.85 v33.02,32.64 | 38.42,17.08 v38.1,17.4
  Top 0.406: X6.39 37.52,11.73 38.1,12.32 38.42,12.32 38.42,17.08 | X5.3 99.69,49.15 v99.69,55.5 | 53.98,48.51 53.98,48.67 53.98,51.69 53.34,52.32 v53.34,52.96 | 102.87,49.15 106.68,49.15 | 102.23,27.56 107.31,27.56 | v44.45,26.92 v44.45,23.75
  Top 0.457: 16.76,47.75 C16.1 | X4.5 8.23,49.58 14.48,49.58 14.48,49.73 15.09,50.34 16.61,50.34 16.61,48.06 C16.1 | LED1.C 47.7,57.51 46.33,57.51 45.87,57.96 43.74,57.96 43.74,53.54 38.1,47.9 C9.2 37.8,47.75 37.34,47.29 37.34,43.48 37.95,42.88 C18.2 37.95,42.57 36.73,41.35 28.5,41.35 | LED3.C 32.31,23.82 32.31,26.26 LED10.C 32.31,26.42 32.31,28.7 LED4.C 32.16,29.01 28.5,32.66 28.5,37.54 C2.1 28.5,37.85 28.5,41.35 | C10.2 21.64,43.03 24.69,43.03 C12.1 24.84,43.03 28.35,43.03 C8.1 28.5,43.33 28.5,41.35 | C16.1 16.92,47.6 21.49,43.03 C10.2 | 54.86,45.01 55.78,44.09 55.78,36.47 55.63,36.32 55.63,35.71 56.08,35.25 58.83,35.25 58.83,37.85 59.13,38.15 59.74,38.15 U$2.53 | 54.86,45.01 54.1,45.77 54.1,48.51 U$2.6 54.1,48.67 53.98,48.67 | v58.67,46.08 59.74,46.08 U$2.63 | 54.86,45.01 v55.93,46.08 | C6.2 60.35,53.85 65.38,53.85 65.38,54.3 C4.2 65.53,53.7 66.75,52.48 66.75,50.65 65.68,49.58 65.68,46.84 | C17.2 65.53,39.06 65.53,45.31 C11.2 65.68,45.47 65.68,46.84 | v65.53,46.84 65.68,46.84 | 82.45,22.61 81.08,23.98 RESET1.4 | 82.45,22.61 83.67,21.39 83.67,11.79 82.3,11.79 U$1.VSS | v75.13,22.15 75.13,21.39 74.98,21.23 CON1.GND | v40.23,37.08 40.23,40.13 40.84,40.74 40.84,41.05 41.3,41.05 42.06,41.81 42.06,42.88 44.2,42.88 U$2.22 | v52.58,27.79 53.95,27.79 R3.1 | X2.3 100.89,27.64 93.27,27.64 93.27,27.79 89,32.05 89,33.73 86.56,36.17 86.56,36.78 U$3.GND | v82.75,22.91 82.45,22.61 | C10.2 21.49,42.72 19.51,40.74 19.51,40.59 18.14,39.22 8.53,39.22 8.53,38 U$6.GND2
  Top 1.778: 7.62,23.11 7.62,28.15 U$6.GND1 U$6.GND2
  Top 2.184: 7.62,23.11 1.27,23.11 1.27,1.52 106.68,1.52 106.68,49.15 106.68,73.91 100.97,73.91 | 100.97,73.91 98.42,73.91 | 98.42,73.91 81.92,73.91 | 81.92,73.91 79.38,73.91 | 79.38,73.91 65.41,73.91 | 65.41,73.91 62.87,73.91 | 62.87,73.91 48.9,73.91 | 48.9,73.91 46.35,73.91 | 46.35,73.91 32.38,73.91 | 32.38,73.91 29.84,73.91 | 29.84,73.91 15.88,73.91 | 15.88,73.91 13.34,73.91 J1.GND2 | 15.88,73.91 J1.GND1 | 29.84,73.91 J2.GND2 | 32.38,73.91 J2.GND1 | 46.35,73.91 J3.GND2 | 48.9,73.91 J3.GND1 | 62.87,73.91 J4.GND2 | 65.41,73.91 J4.GND1 | 79.38,73.91 J5.GND2 | 81.92,73.91 J5.GND1 | 98.42,73.91 I2C-J4.GND2 | 100.97,73.91 I2C-J4.GND1
  Top 2.54: U$6.GND2 7.62,37.04 7.62,23.11 Q7.3
  Bottom 0.356: v90.17,25.02 90.81,24.38 | v33.02,32.64 33.02,33.91 32.38,34.54 | v38.1,17.4 38.1,18.03
  Bottom 0.406: v99.69,55.5 99.69,56.13
  Bottom 0.457: v55.93,46.08 v58.67,46.08 59.44,46.84 v65.53,46.84 | v75.13,22.15 76.5,23.52 82.45,23.52 82.91,23.06 | 82.91,23.06 84.12,21.84 C3.1 | v40.23,37.08 38.86,35.71 38.25,35.71 IC1.1 | v52.58,27.79 52.43,27.64 39.62,27.64 C1.2 | v82.75,22.91 82.91,23.06
  Bottom 1.27: Q2.3 31.75,69.39 31.75,73.91 32.38,73.91 J2.GND1 | Q4.3 48.26,69.39 48.26,73.91 48.9,73.91 J3.GND1 | Q5.3 64.77,69.39 64.77,73.91 65.41,73.91 J4.GND1 | Q6.3 81.28,69.39 81.28,73.91 81.92,73.91 J5.GND1 | Q1.3 15.24,69.39 15.24,73.91 15.88,73.91 J1.GND1
  pour Bottom: -0.64,84.71 108.58,84.71 108.58,83.44 108.58,-0.38 0,-0.38 -0.64,-0.38
GND1
  Bottom 0.457: U$3.RUN 85.34,52.02 85.34,51.26 86.11,50.49 86.72,50.49 88.85,48.36 LED9.C
GND2
  Bottom 0.457: U$3.NET 83.97,52.02 83.97,50.65 86.26,48.36 LED11.C
GND3
  Bottom 0.457: U$3.ALM 82.75,52.02 82.75,50.95 83.82,49.89 LED12.C
HWB
  Top 0.356: U$2.43 54.1,33.12 54.1,29.92 R3.2
ISP+5V  (via drill 0.3)
  Top 0.356: v71.78,22.91 71.78,21.84 72.39,21.23 CON1.5V
  Bottom 0.356: 70.56,24.13 70.62,24.07 | 70.62,24.07 v71.78,22.91 | D2.A 18.9,42.11 19.81,42.11 19.81,27.79 27.66,19.94 42.55,19.94 46.67,24.07 70.62,24.07
MISO  (via drill 0.3)
  Top 0.356: v74.83,17.42 72.39,19.86 CON1.MISO 72.24,19.86 72.24,19.56 70.87,19.56 69.19,21.23 69.19,37.24 v68.89,37.54 | v80.62,14.83 82.14,14.83 82.14,14.22 U$1.SO | v55.02,38.91 48.62,45.31 48.62,48.51 U$2.13
  Bottom 0.356: v74.83,17.42 77.42,14.83 v80.62,14.83 | v55.02,38.91 56.39,37.54 v68.89,37.54
MOSI  (via drill 0.3)
  Top 0.356: v69.8,48.36 69.8,28.55 72.54,25.81 72.54,22.3 73.61,21.23 CON1.MOSI | v49.38,50.8 49.38,48.67 U$2.12
  Bottom 0.356: v69.8,48.36 67.51,50.65 49.38,50.65 | 49.38,50.65 41.3,50.65 40.69,51.26 D5.C | v49.38,50.8 49.38,50.65
N$1
  Bottom 0.406: Q4.2 45.72,66.29 41.91,66.29 41.91,58.67 LED6.C
  Bottom 1.27: Q4.2 45.72,73.91 43.81,73.91 J3.PWM
N$2
  Bottom 0.406: J2.I/O 28.57,80.9 37.47,80.9 R32.2
N$3
  Top 0.356: RL5.2 51.36,55.22 51.36,57.35 LED1.A
N$4
  Bottom 0.406: LED5.A 33.02,58.67 R4.1
N$5
  Bottom 0.406: LED7.C 58.42,58.67 58.42,66.29 62.23,66.29 Q5.2
  Bottom 1.27: Q5.2 62.23,73.91 60.33,73.91 J4.PWM
N$6
  Top 0.356: RL2.2 16.76,15.6 12.8,15.6 12.8,19.25 Q7.1
N$7
  Bottom 0.406: J3.I/O 45.09,80.9 53.98,80.9 R33.2
N$8  (via drill 0.3)
  Top 0.356: v55.02,43.79 53.34,45.47 53.34,48.51 U$2.7 | v71.32,37.08 73.61,34.8 73.61,27.94 v78.79,22.76
  Bottom 0.356: v55.02,43.79 59.44,39.37 69.04,39.37 v71.32,37.08 | v78.79,22.76 79.7,21.84 C3.2
N$9
  Top 0.457: 97.54,31.29 97.54,32.51 R21.2 | 97.54,31.29 97.54,30.84 94.34,30.84 RL8.2 | 97.54,31.29 103.94,31.29 103.94,40.89 100.89,43.94 100.43,43.94 X5.2
N$10
  Top 0.356: R16.1 74.07,13.01 74.83,13.77 74.83,14.99 75.74,15.9 75.74,16.05 R17.1 75.59,15.6 82.14,15.6 U$1.CE
N$11
  Bottom 0.356: R11.2 87.02,30.53 87.78,31.29 87.94,31.29 88.09,31.45 88.09,35.41 84.89,35.41 83.97,36.32 83.97,36.78 U$3.RX1
N$12
  Top 0.356: RL4.2 24.99,28.85 28.65,28.85 LED4.A
N$13
  Top 0.356: 60.2,48.36 60.2,50.8 C6.1 | 60.2,48.36 60.2,47.14 59.89,46.84 U$2.64 | 60.2,48.36 62.79,48.36 L_AVCC.2
N$14  (via drill 0.3)
  Top 0.356: v41.45,40.28 42.37,41.2 44.2,41.2 U$2.24 | v36.12,40.28 34.29,38.46 X3.P$2 34.14,38.3 34.14,37.85 31.39,37.85 C2.2
  Bottom 0.356: v36.12,40.28 v41.45,40.28
N$17
  Bottom 0.406: LED2.A 16.51,58.67 R25.1
N$18
  Bottom 0.406: J1.I/O 12.06,80.9 20.95,80.9 R.2
N$19
  Bottom 0.406: Q6.2 78.74,66.29 74.93,66.29 74.93,58.67 LED8.C
  Bottom 1.27: Q6.2 78.74,73.91 76.83,73.91 J5.PWM
N$20
  Top 0.356: R27.1 25.15,23.82 28.65,23.82 LED3.A
N$21
  Top 0.457: 93.42,22.61 93.42,21.39 R10.2 | 93.42,22.61 93.42,24.59 RL6.2 | 93.42,22.61 100.89,22.61 X2.2
N$22
  Bottom 0.406: LED6.A 49.53,58.67 R5.1
N$23  (via drill 0.3)
  Top 0.356: v81.23,33.88 84.12,30.99 84.12,28.4 87.78,24.74 87.78,14.07 88.85,13.01 90.22,13.01 U$1.SCK
  Bottom 0.356: v81.23,33.88 77.42,33.88 71.32,39.98 64.47,39.98 59.89,44.55 53.19,44.55 53.03,44.7 R18.2
N$24  (via drill 0.3)
  Top 0.356: v83.82,32.82 82.75,33.88 82.75,36.78 U$3.TX1
  Bottom 0.356: v83.82,32.82 84.58,32.82 85.04,32.36 R8.2
N$25
  Bottom 0.356: R12.1 89,42.57 89,44.86 LED9.A
N$26
  Bottom 0.356: R14.1 86.41,42.57 86.41,44.86 LED11.A
N$27
  Bottom 0.356: LED12.A R39.1
N$28
  Bottom 0.406: Q2.2 29.21,66.29 25.4,66.29 25.4,58.67 LED5.C
  Bottom 1.27: Q2.2 29.21,73.91 27.3,73.91 J2.PWM
N$29
  Bottom 0.406: J4.I/O 61.59,80.9 70.48,80.9 R34.2
N$30
  Bottom 0.406: LED7.A 66.04,58.67 R6.1
N$32
  Bottom 0.406: J5.I/O 78.11,80.9 87,80.9 R35.2
N$33
  Bottom 0.406: LED8.A 82.87,58.99 R7.1
N$34
  Bottom 0.406: Q1.2 12.7,66.29 8.89,66.29 8.89,58.67 LED2.C
  Bottom 1.27: Q1.2 12.7,73.91 10.79,73.91 J1.PWM
N$35
  Bottom 0.356: 76.2,52.02 U$3.CFG 76.2,51.87 76.2,47.6 76.5,47.6 CFG.4
N$36
  Top 2.54: Q7.2 22.86,7.87 J7.2
N$39  (via drill 0.3)
  Top 0.356: v46.02,42.11 44.35,42.11 U$2.23 | v36.27,42.11 34.29,42.11 X3.P$1 34.14,43.48 31.39,43.48 C8.2
  Bottom 0.356: v36.27,42.11 v46.02,42.11
N$75
  Top 0.356: RL3.1 25.15,26.42 28.65,26.42 LED10.A
RESET  (via drill 0.3)
  Top 0.356: C9.1 40.69,47.75 40.39,47.45 40.39,45.47 R15.1 40.39,45.31 40.39,44.55 44.2,44.55 U$2.20 44.35,44.4 44.96,44.4 46.79,42.57 v46.79,37.08 | 79.55,25.81 79.55,20.62 75.59,20.62 74.98,20.02 CON1.RESET | 79.55,25.81 79.86,26.11 85.34,26.11 85.34,24.13 RESET1.2 | v63.25,36.78 67.36,32.66 v67.36,31.75 | v76.66,28.55 79.4,25.81 79.55,25.81
  Bottom 0.356: v46.79,37.08 47.09,36.78 v63.25,36.78 | v67.36,31.75 70.56,28.55 v76.66,28.55
RX  (via drill 0.3)
  Top 0.356: v42.52,32.97 42.52,38.91 44.2,38.91 U$2.27
  Bottom 0.356: v42.52,32.97 43.28,32.21 66.9,32.21 67.21,32.51 82.91,32.51 84.89,30.53 85.04,30.53 R8.1
SCK  (via drill 0.3)
  Top 0.356: v74.22,19.25 74.22,19.41 73.76,19.86 CON1.SCK | v74.22,26.26 70.56,29.92 v70.56,46.99 | v52.12,45.92 50.14,47.9 50.14,48.51 U$2.11
  Bottom 0.356: v74.22,26.26 v74.22,19.25 | v70.56,46.99 69.95,47.6 53.95,47.6 52.2,45.85 | 52.2,45.85 51.05,44.7 R18.1 | v52.12,45.92 52.2,45.85
SCL  (via drill 0.3)
  Top 0.356: v41.76,33.58 41.76,38.91 42.37,39.52 42.37,40.44 44.2,40.44 U$2.25 | v88.39,50.65 v74.07,36.32
  Bottom 0.356: 94.03,57.35 94.49,57.35 | 94.03,57.35 93.98,57.4 | v41.76,33.58 41.91,33.73 63.55,33.73 63.7,33.58 66.75,33.58 69.49,36.32 v74.07,36.32 | v88.39,50.65 93.27,50.65 94.03,51.41 94.03,57.35
  Bottom 0.406: I2C-J4.SCL 95.89,68.52 96.52,68.52 R28.2 93.98,65.97 93.98,57.4
SDA  (via drill 0.3)
  Top 0.356: v45.26,29.16 45.26,33.58 45.87,34.19 45.87,39.67 44.35,39.67 U$2.26
  Bottom 0.356: 101.92,57.4 101.8,57.35 101.8,36.47 92.35,27.03 70.26,27.03 66.14,31.14 59.28,31.14 57.45,29.31 45.41,29.31 v45.26,29.16
  Bottom 0.406: I2C-J4.SDA 97.16,71.06 99.06,71.06 R29.2 101.92,65.97 101.92,57.4
TFT-CS  (via drill 0.3)
  Top 0.356: v46.02,14.22 46.02,33.12 U$2.33
  Bottom 0.356: v46.02,14.22 46.79,13.46 55.47,13.46 55.63,13.61 60.66,13.61 65.38,8.89 X6.11
TFT-DB0  (via drill 0.3)
  Top 0.356: v47.85,21.69 47.85,23.52 47.7,23.67 47.7,33.12 U$2.35 | v37.13,13.26 36.42,12.55 36.42,7.98 37.49,6.91 X6.40
  Bottom 0.356: v47.85,21.69 46.63,20.47 44.35,20.47 v37.13,13.26
TFT-DB1  (via drill 0.3)
  Top 0.356: v48.46,30.38 48.46,33.12 U$2.36 | v38.71,29.92 35.81,27.03 35.81,7.06 37.03,5.84 39.47,5.84 39.47,6.76 X6.38
  Bottom 0.356: v48.46,30.38 48.01,29.92 v38.71,29.92
TFT-DB2  (via drill 0.3)
  Top 0.356: v49.23,30.38 49.23,33.12 U$2.37 | v38.71,31.14 35.2,27.64 35.2,6.91 36.88,5.23 41.45,5.23 41.45,6.76 X6.36
  Bottom 0.356: v49.23,30.38 49.23,31.14 v38.71,31.14
TFT-DB3  (via drill 0.3)
  Top 0.356: v45.11,12.4 49.99,17.27 49.99,33.12 U$2.38 | v41.3,4.32 43.43,6.45 43.43,6.76 X6.34
  Bottom 0.356: v45.11,12.4 44.2,11.48 37.03,11.48 34.9,9.35 34.9,4.32 v41.3,4.32
TFT-DB4  (via drill 0.3)
  Top 0.356: v45.87,12.24 50.6,16.97 50.6,32.21 50.75,32.36 50.75,33.12 U$2.39 | v43.74,5.08 45.41,6.76 X6.32
  Bottom 0.356: v45.87,12.24 44.2,10.57 36.88,10.57 35.81,9.5 35.81,5.08 v43.74,5.08
TFT-DB5  (via drill 0.3)
  Top 0.356: U$2.40 51.51,32.97 51.51,32.36 51.21,32.05 51.21,16.36 50.44,15.6 v50.44,12.7
  Bottom 0.356: v50.44,12.7 47.7,9.96 37.03,9.96 36.42,9.35 36.42,5.84 46.48,5.84 47.4,6.76 X6.30
TFT-DB6  (via drill 0.3)
  Top 0.356: v52.27,15.6 52.27,15.9 51.82,16.36 51.82,30.53 52.43,31.14 52.43,33.12 U$2.41
  Bottom 0.356: v52.27,15.6 51.66,14.99 39.78,14.99 34.29,9.5 34.29,3.56 46.18,3.56 49.38,6.76 X6.28
TFT-DB7  (via drill 0.3)
  Top 0.356: v46.63,35.1 51.97,35.1 53.19,33.88 53.19,33.27 U$2.42 | v38.71,34.95 34.59,30.84 34.59,6.76 37.8,3.56 51.51,3.56 51.51,6.76 X6.26
  Bottom 0.356: v46.63,35.1 46.48,34.95 v38.71,34.95
TFT-DB8  (via drill 0.3)
  Top 0.356: v59.44,16.82 59.44,17.27 61.42,19.25 61.42,36.47 59.89,36.47 U$2.51 | v51.51,15.75 51.21,15.44 51.21,10.57 49.53,8.89 X6.27
  Bottom 0.356: v59.44,16.82 58.98,16.36 52.12,16.36 v51.51,15.75
TFT-DB9  (via drill 0.3)
  Top 0.356: v59.44,30.38 60.81,31.75 60.81,35.71 59.89,35.71 U$2.50 | v54.56,25.81 53.03,24.28 53.03,10.26 51.66,8.89 X6.25
  Bottom 0.356: v59.44,30.38 54.86,25.81 v54.56,25.81
TFT-DB10  (via drill 0.3)
  Top 0.356: v58.52,12.24 58.52,15.14 58.67,15.29 58.67,33.88 59.74,34.95 U$2.49
  Bottom 0.356: v58.52,12.24 58.06,11.79 56.39,11.79 53.49,8.89 X6.23
TFT-DB11  (via drill 0.3)
  Top 0.356: v57.91,11.02 57.76,11.18 57.76,12.4 57.91,12.55 57.91,33.12 U$2.48
  Bottom 0.356: v57.91,11.02 56.39,11.02 55.63,10.26 55.63,8.89 X6.21
TFT-DB12
  Top 0.356: U$2.47 57.15,33.12 57.15,10.57 57.45,10.26 57.45,8.89 X6.19
TFT-DB13  (via drill 0.3)
  Top 0.356: v56.54,10.26 56.54,33.12 U$2.46
  Bottom 0.356: v56.54,10.26 56.84,9.96 58.37,9.96 59.44,8.89 X6.17
TFT-DB14  (via drill 0.3)
  Top 0.356: U$2.45 55.78,32.97 55.78,30.68 55.93,30.53 55.93,13.01 v55.78,12.85
  Bottom 0.356: v55.78,12.85 55.93,13.01 58.67,13.01 61.42,10.26 61.42,8.89 X6.15
TFT-DB15  (via drill 0.3)
  Top 0.356: v55.17,15.6 55.32,15.75 55.32,30.38 54.86,30.84 54.86,33.12 U$2.44 | v59.28,14.99 63.4,10.87 63.4,8.89 X6.13
  Bottom 0.356: v55.17,15.6 55.78,14.99 v59.28,14.99
TFT-RESET  (via drill 0.3)
  Top 0.356: v47.09,23.37 47.09,33.12 U$2.34 | v61.42,18.34 69.49,10.26 69.49,8.89 X6.7
  Bottom 0.356: v47.09,23.37 52.12,18.34 v61.42,18.34
TFT-RS  (via drill 0.3)
  Top 0.356: v47.55,40.89 47.55,42.57 45.41,44.7 45.41,45.92 44.35,45.92 U$2.18 | v41,38.61 41,33.88 40.84,33.73 40.84,11.48 43.43,8.89 X6.33
  Bottom 0.356: v47.55,40.89 45.26,38.61 v41,38.61
TX  (via drill 0.3)
  Top 0.356: v44.5,32.97 44.5,33.58 45.26,34.34 45.26,38 44.35,38 U$2.28
  Bottom 0.356: v44.5,32.97 66.9,32.97 67.06,33.12 83.21,33.12 83.67,33.58 85.8,33.58 87.02,32.36 R11.1
USB_N
  Top 0.356: R31.1 37.11,52.96 43.71,59.56 54.86,59.56 54.86,53.06 55.5,52.43 55.5,48.67 | 55.5,48.67 55.5,48.51 | U$2.4 55.63,48.67 55.5,48.67
USB_P
  Top 0.356: R24.1 34.65,49.78 43.92,59.05 54.36,59.05 54.36,52.85 54.99,52.22 54.99,48.67 | 54.99,48.67 54.99,48.51 | U$2.5 54.86,48.67 54.99,48.67
USBC_N
  Top 0.406: X4.2 18.22,51.85 19.84,52.96 R31.2
USBC_P
  Top 0.406: X4.3 12.06,51.05 18.52,51 R24.2
VUSB  (via drill 0.3)
  Top 0.356: 13.87,48.06 C16.2 | X4.1 8.08,52.63 6.1,52.63 6.1,49.12 7.16,48.06 13.72,48.06 C16.2 | v18.75,40.89 13.87,45.77 13.87,47.75 C16.2 | v52.58,51.41 52.58,48.67 U$2.8 | v56.24,51.41 56.39,51.26 56.39,48.67 U$2.3 | v15.54,49.58 14.02,48.06 C16.2
  Bottom 0.356: v18.75,40.89 18.75,39.67 D4.A | v56.24,51.41 v52.58,51.41 52.43,51.41 51.51,52.32 21.64,52.32 C7.2 21.49,52.32 18.29,52.32 v15.54,49.58

### Text on the board
tNames: BioReactor | Control Board v2 | 1 | 1 | w5100
bNames: USB | TX/RX | LINKLED
tValues: GND | DAT | Tliquid | 5V | GND | DAT | Tplate | Screen | 5V | PID | GND | +5V | RS | WR | RD | DB8 | DB9 | DB10 | DB11 | DB12 | DB13 | DB14 | DB15 | CS | RSET | LEd | DB0 | DB1 | DB2 | DB3 | DB4 | DB5 | DB6 | DB7
203bmp: C:/Users/G/Pictures/logo_epfl.bmp